# Altium schematic sheet Schematic.SchDoc
size A4; SheetNumber: 1; SheetTotal: 1
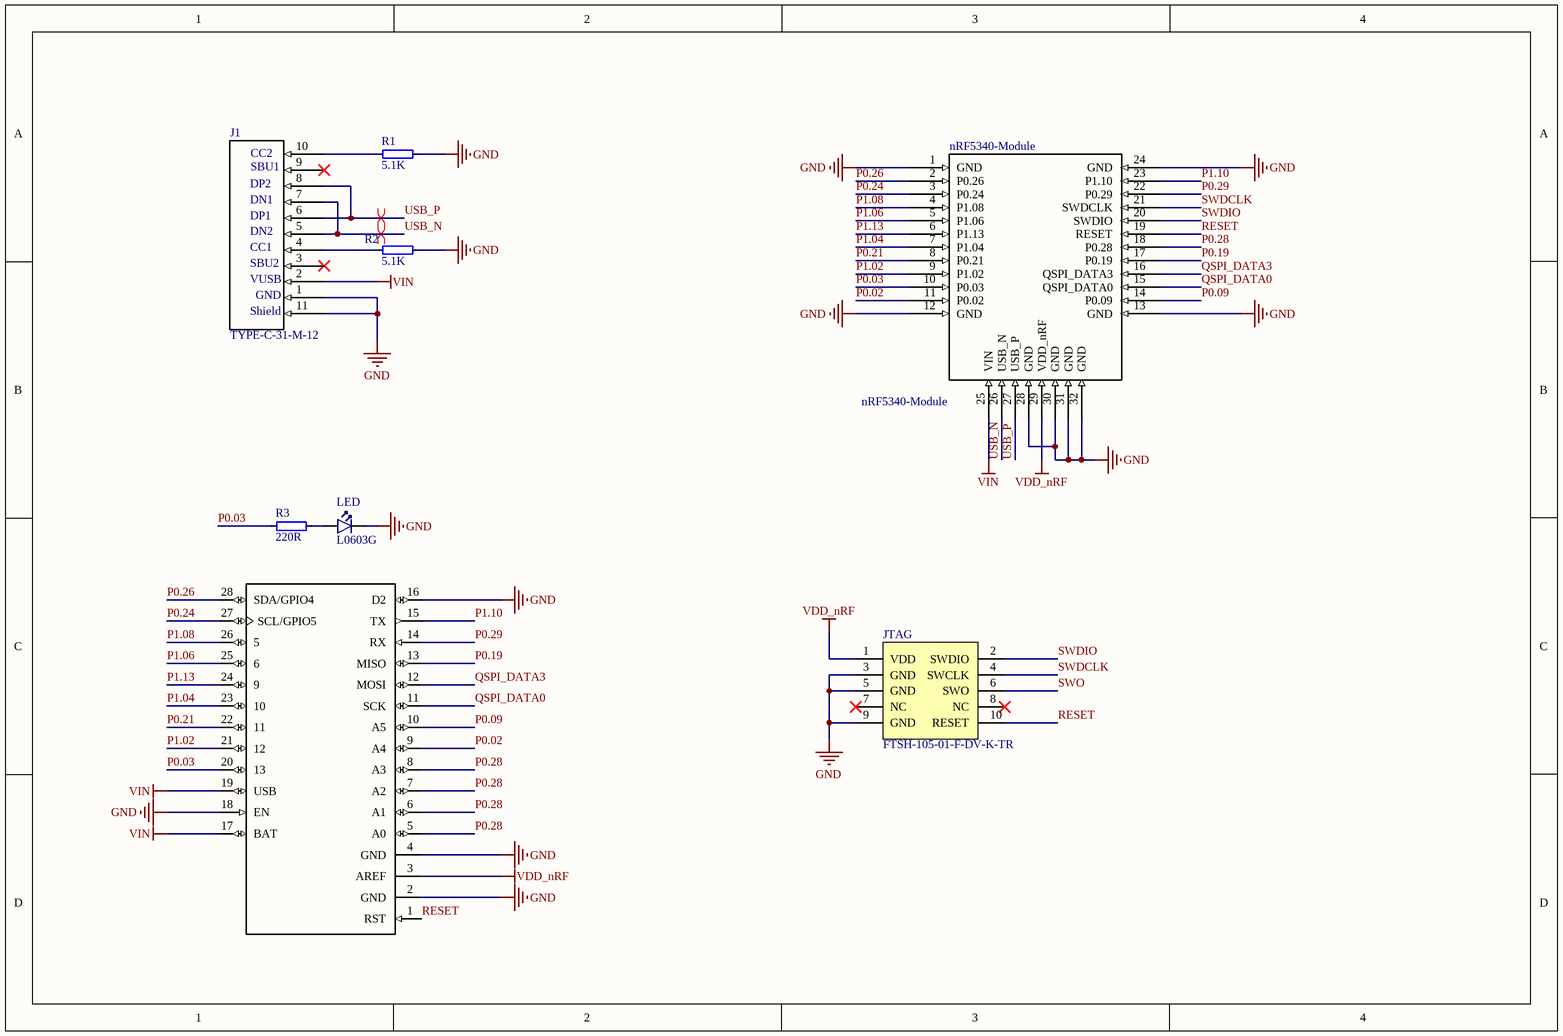
[diagram p0: Schematic.SchDoc]

## Parts
Feather  DNP  [Feather]  (value not drawn)
J1  TYPE-C-31-M-12  [TYPE-C-31-M-12]
JTAG  FTSH-105-01-F-DV-K-TR  [HDR_2x5-SMD-1.27mm-K_2]
LED  L0603G  [LED_0603]
nRF5340-Module  nRF5340-Module  [nRF53-Module]
R1  5.1K  [RES0603R]
R2  5.1K  [RES0603R]
R3  220R  [RES0603R]

## Nets
GND: Feather.2(GND) Feather.4(GND) Feather.16(D2) Feather.18(EN) J1.1 J1.11 JTAG.3(GND) JTAG.5(GND) JTAG.9(GND) LED.1(C) nRF5340-Module.1(GND) nRF5340-Module.12(GND) nRF5340-Module.13(GND) nRF5340-Module.24(GND) nRF5340-Module.28(GND) nRF5340-Module.30(GND) nRF5340-Module.31(GND) nRF5340-Module.32(GND) R1.2 R2.2
VDD_nRF: Feather.3(AREF) JTAG.1(VDD) nRF5340-Module.29(VDD_nRF)
VIN: Feather.17(BAT) Feather.19(USB) J1.2 nRF5340-Module.25(VIN)
P0.02: Feather.9(A4) nRF5340-Module.11(P0.02)
P0.03: Feather.20(13) nRF5340-Module.10(P0.03) R3.1
P0.09: Feather.10(A5) nRF5340-Module.14(P0.09)
P0.19: Feather.13(MISO) nRF5340-Module.17(P0.19)
P0.21: Feather.22(11) nRF5340-Module.8(P0.21)
P0.24: Feather.27(SCL/GPIO5) nRF5340-Module.3(P0.24)
P0.26: Feather.28(SDA/GPIO4) nRF5340-Module.2(P0.26)
P0.28: Feather.5(A0) Feather.6(A1) Feather.7(A2) Feather.8(A3) nRF5340-Module.18(P0.28)
P0.29: Feather.14(RX) nRF5340-Module.22(P0.29)
P1.02: Feather.21(12) nRF5340-Module.9(P1.02)
P1.04: Feather.23(10) nRF5340-Module.7(P1.04)
P1.06: Feather.25(6) nRF5340-Module.5(P1.06)
P1.08: Feather.26(5) nRF5340-Module.4(P1.08)
P1.10: Feather.15(TX) nRF5340-Module.23(P1.10)
P1.13: Feather.24(9) nRF5340-Module.6(P1.13)
QSPI_DATA0: Feather.11(SCK) nRF5340-Module.15(QSPI_DATA0)
QSPI_DATA3: Feather.12(MOSI) nRF5340-Module.16(QSPI_DATA3)
RESET: Feather.1(RST) JTAG.10(RESET) nRF5340-Module.19(RESET)
SWDCLK: JTAG.4(SWCLK) nRF5340-Module.21(SWDCLK)
SWDIO: JTAG.2(SWDIO) nRF5340-Module.20(SWDIO)
SWO: JTAG.6(SWO)
USB_N: J1.5 J1.7 nRF5340-Module.26(USB_N)
USB_P: J1.6 J1.8 nRF5340-Module.27(USB_P)
NetJ1_4: J1.4 R2.1
NetJ1_10: J1.10 R1.1
NetLED_2: LED.2(A) R3.2

Not connected (* = marked no-connect by the designer): J1 3* 9*; JTAG 7(NC)* 8(NC)*

## Layout directives
differential pair: USB_N, USB_P

## Notes on the sheet
- (in symbol USB-C 2.0) CC2; SBU1; DP2; DN1; DP1; DN2; CC1; SBU2; VUSB; GND; Shield

## Library data of the parts
Feather = Adafruit Feather: Adafruit Feather Footprint; MF: Adafruit Industries; MP: 2821; Price: None; Package: None; Availability: Unavailable; SnapEDA_Link: https://www.snapeda.com/parts/2821/Adafruit%20Industries%20LLC/view-part/?ref=snap; Value: *
J1 = USB-C 2.0: USB C connector; ComponentLink1Description: LCSC; ComponentLink1URL: https://lcsc.com/product-detail/USB-Connectors_Korean-Hroparts-Elec-TYPE-C-31-M-12_C165948.html
JTAG = JTAG: Pin Header 2x5, 1.27mm (50mil), SMD, Keying Shroud; Part Number: Pin Header 2x5 SMD, 1.27mm, KS; Manufacturer: W-CON; Manufacturer Part Number: 3132-10MS0BK00R1; Part number IPS: N.A.; Artikkelnr Noca: 55010009; Footprint Doc: HDR_2x5-SMD-1.27mm; LatestRevisionDate: 2016-04-21; Pin Count: 10; Publisher: Nordic Semiconductor; Published: 2016-01-22; Value: Pin Header 2x5, 1.27mm; Note: *; ComponentLink1URL: *; ComponentLink1Description: Datasheet; ComponentLink2URL: *; ComponentLink2Description: Supplier link; HelpURL: \\hizz\pro\app9717\Datasheet\connectores\W-CON\3132-XXMXXBK00XX.pdf; Supplier 1: Cabcon; Supplier Part Number 1: 3132-10MS0BK00R1; Supplier 2: Samtec; Supplier Part Number 2: FTSH-105-01-F-DV-K
LED = D:LED: LED, Green, 0603, 570nm, Vf=1.7V, 2.24..5.6mcd, - 40 to +100°C; Part Number: LG L29K Smartled Green; Manufacturer: Osram; Manufacturer Part Number: LG L29K-G2J1-24-Z; Part number IPS: N.A.; Note: 2.24..5.6 mcd, Vfmin=1.7V; Artikkelnr Noca: 13019147; Footprint Doc: 0603; LatestRevisionDate: 2017-08-21; Pin Count: 2; Publisher: Nordic Semiconductor; Published: 2014-10-28; Value: L0603G; ComponentLink1URL: *; ComponentLink1Description: Datasheet; ComponentLink2URL: *; ComponentLink2Description: Supplier link; HelpURL: http://www.osram-os.com/Graphics/XPic2/00077107_0.pdf; Supplier 1: Digi-Key; Supplier Part Number 1: 475-2709-1-ND; Supplier 2: Mouser; Supplier Part Number 2: 720-LGL29KG2J124Z
nRF5340-Module = nRF5340-Module: nRF5340-Module Available on https://www.hackster.io/kattemjau
R1-R3 = RES: Resistor, ±5%, 0.05W; Part Number: R0201-0R; Part number IPS: 00000003245; Value: 0R; Note: Chip Res 5%; Artikkelnr Noca: N.A.; Manufacturer: *; Manufacturer Part Number: *; ComponentLink1URL: *; ComponentLink1Description: Datasheet; ComponentLink2URL: *; ComponentLink2Description: Supplier link; HelpURL: *; Footprint Doc: 0201; LatestRevisionDate: 2017-11-09; Pin Count: 2; Publisher: Nordic Semiconductor; Published: 2014-11-13; Supplier 1: *; Supplier Part Number 1: *; Supplier 2: *; Supplier Part Number 2: *